# EAGLE design tic_tac_toe (EAGLE 9.6.2)
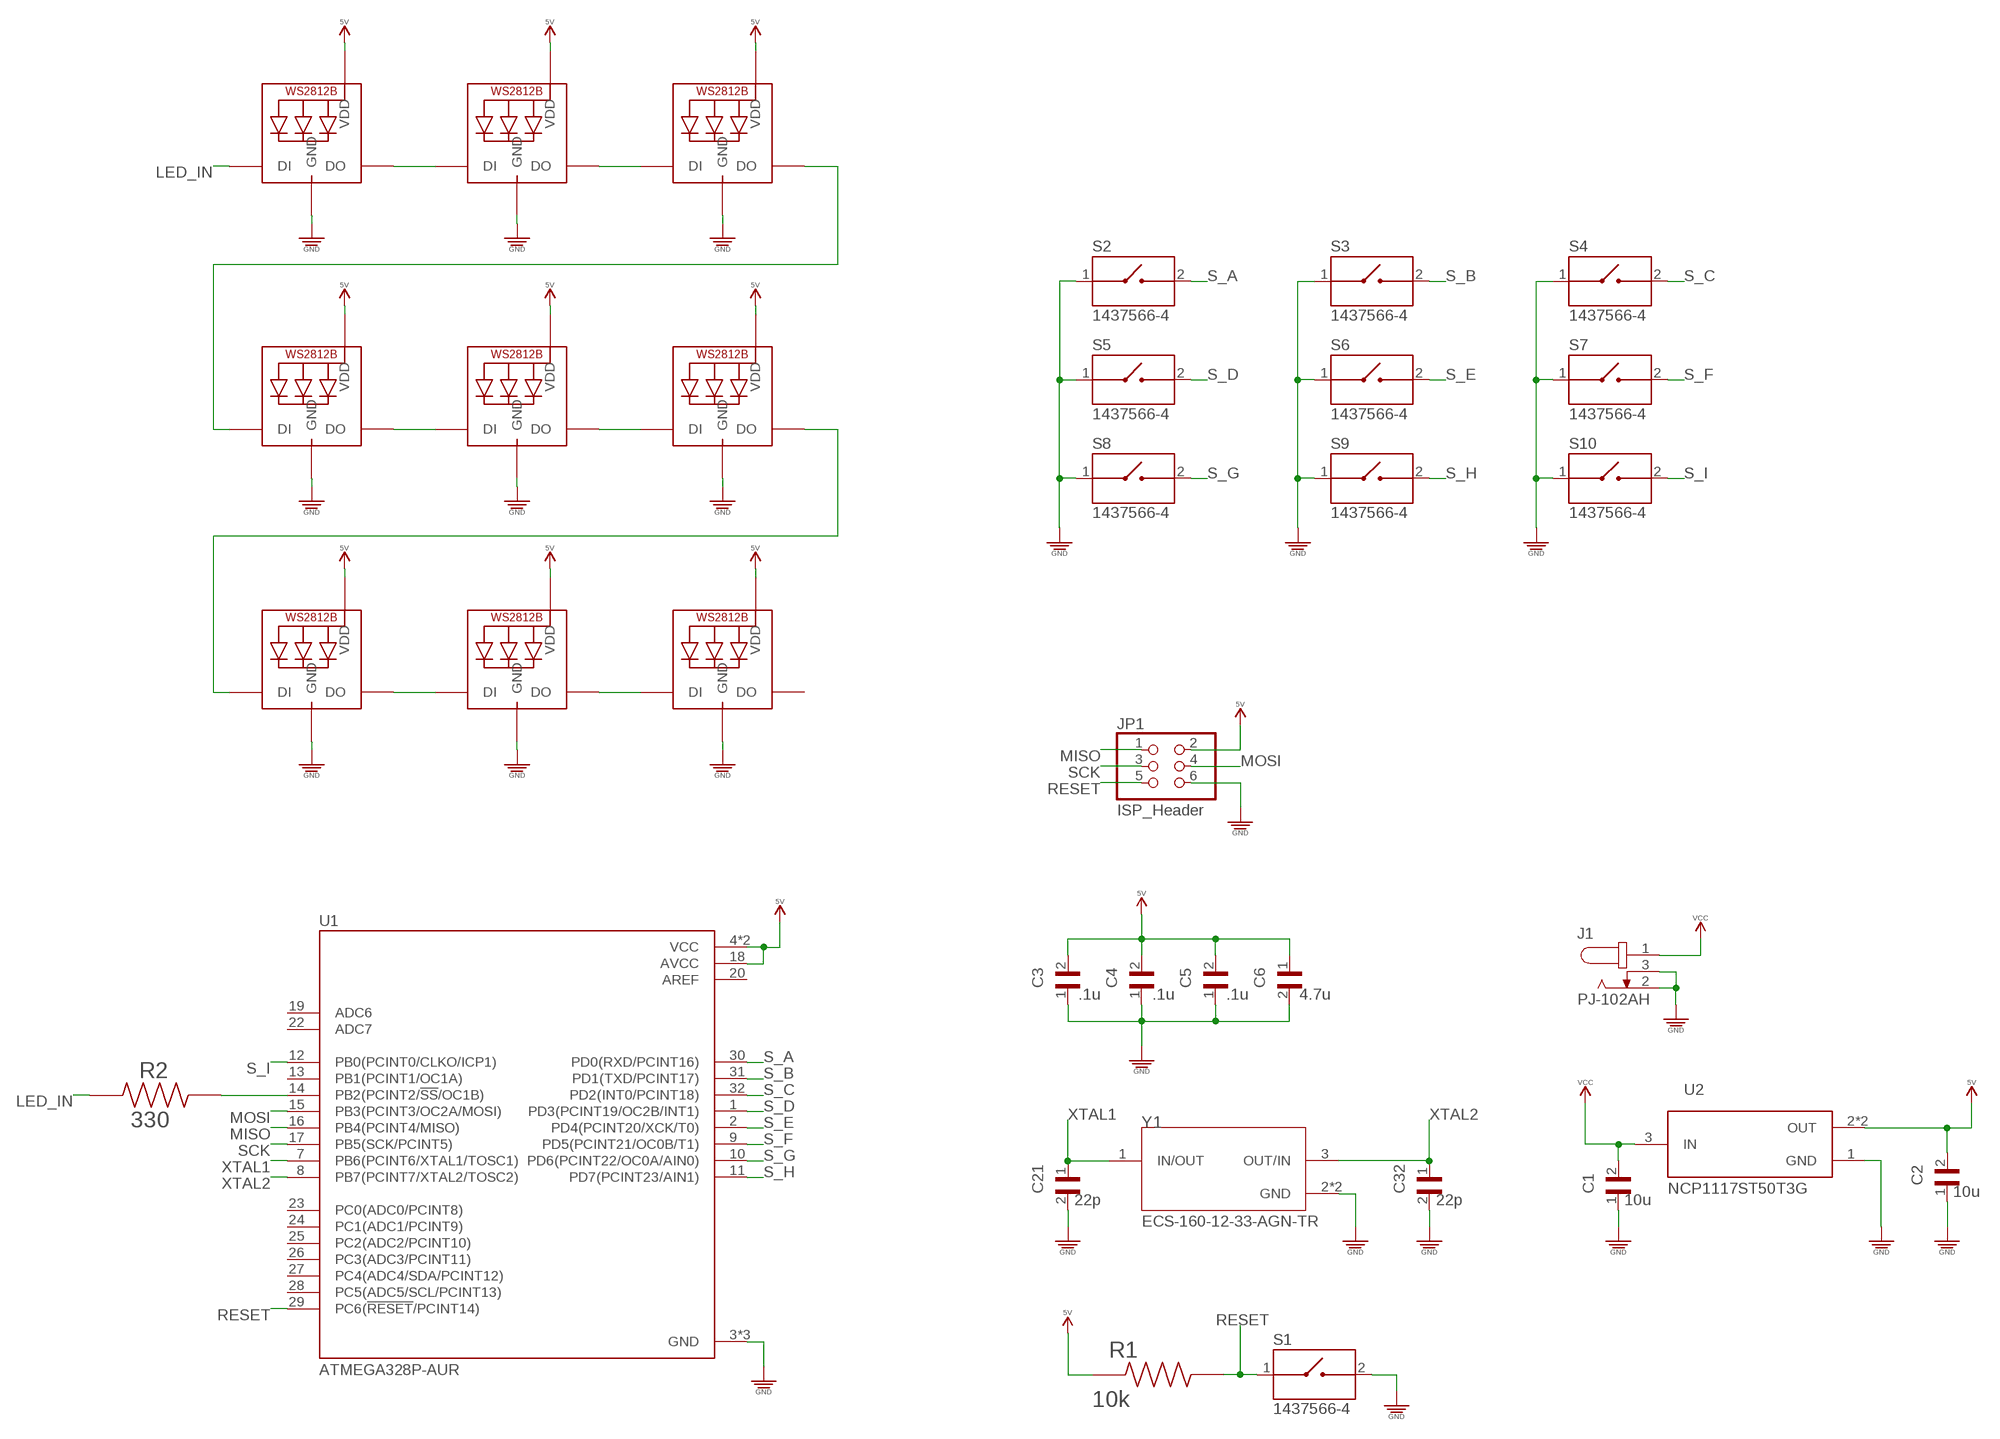
[diagram p0: schematic, sheet 1]

## Parts
C1  10u  TAJR106M006R  [CAPC2012X140N]
C2  10u  TAJR106M006R  [CAPC2012X140N]
C3  .1u  08055F104K4T2A  [CAPC2012X140N]
C4  .1u  08055F104K4T2A  [CAPC2012X140N]
C5  .1u  08055F104K4T2A  [CAPC2012X140N]
C6  4.7u  CL21A475KAQNNNE  [CAPC2012X140N]
C21  22p  C0805C220J5GACTU  [CAPC2012X140N]
C32  22p  C0805C220J5GACTU  [CAPC2012X140N]
J1  PJ-102AH  [CUI_PJ-102AH]
JP1  ISP_Header  PINHD-2X3  [2X03]
LED1  MICROBUILDER_WS2812B_SK6812E  [MICROBUILDER_NEO3535_REVERSE]
LED2  MICROBUILDER_WS2812B_SK6812E  [MICROBUILDER_NEO3535_REVERSE]
LED3  MICROBUILDER_WS2812B_SK6812E  [MICROBUILDER_NEO3535_REVERSE]
LED4  MICROBUILDER_WS2812B_SK6812E  [MICROBUILDER_NEO3535_REVERSE]
LED5  MICROBUILDER_WS2812B_SK6812E  [MICROBUILDER_NEO3535_REVERSE]
LED6  MICROBUILDER_WS2812B_SK6812E  [MICROBUILDER_NEO3535_REVERSE]
LED7  MICROBUILDER_WS2812B_SK6812E  [MICROBUILDER_NEO3535_REVERSE]
LED8  MICROBUILDER_WS2812B_SK6812E  [MICROBUILDER_NEO3535_REVERSE]
LED9  MICROBUILDER_WS2812B_SK6812E  [MICROBUILDER_NEO3535_REVERSE]
R1  10k  CR0805-FX-1002ELF  [RESC2012X60N]
R2  330  RC1206FR-07330RL  [RESC3116X65N]
S1  1437566-4  [SW_1437566-4]
S2  1437566-4  [SW_1437566-4]
S3  1437566-4  [SW_1437566-4]
S4  1437566-4  [SW_1437566-4]
S5  1437566-4  [SW_1437566-4]
S6  1437566-4  [SW_1437566-4]
S7  1437566-4  [SW_1437566-4]
S8  1437566-4  [SW_1437566-4]
S9  1437566-4  [SW_1437566-4]
S10  1437566-4  [SW_1437566-4]
U1  ATMEGA328P-AUR  [QFP80P900X900X120-32N]
U2  NCP1117ST50T3G  [SOT230P700X180-4N]
Y1  ECS-160-12-33-AGN-TR  [XTAL_ECS-160-12-33-AGN-TR]

## Nets
5V: C2.2 C3.2 C4.2 C5.2 C6.1 JP1.2 LED1.1-VDD(VDD) LED2.1-VDD(VDD) LED3.1-VDD(VDD) LED4.1-VDD(VDD) LED5.1-VDD(VDD) LED6.1-VDD(VDD) LED7.1-VDD(VDD) LED8.1-VDD(VDD) LED9.1-VDD(VDD) R1.1 U1.4(VCC) U1.6(VCC) U1.18(AVCC) U2.2(OUT) U2.4(OUT)
GND: C1.1 C2.1 C3.1 C4.1 C5.1 C6.2 C21.2 C32.2 J1.2 J1.3 JP1.6 LED1.3-GND(GND) LED2.3-GND(GND) LED3.3-GND(GND) LED4.3-GND(GND) LED5.3-GND(GND) LED6.3-GND(GND) LED7.3-GND(GND) LED8.3-GND(GND) LED9.3-GND(GND) S1.2 S2.1 S3.1 S4.1 S5.1 S6.1 S7.1 S8.1 S9.1 S10.1 U1.3(GND) U1.5(GND) U1.21(GND) U2.1(GND) Y1.2(GND) Y1.4(GND)
LED_IN: LED1.4-DIN(DI) R2.1
MISO: JP1.1 U1.16(PB4(PCINT4/MISO))
MOSI: JP1.4 U1.15(PB3(PCINT3/OC2A/MOSI))
N$1: R2.2 U1.14(PB2(PCINT2/!SS!/OC1B))
N$2: LED1.2-DOUT(DO) LED2.4-DIN(DI)
N$3: LED2.2-DOUT(DO) LED3.4-DIN(DI)
N$4: LED4.2-DOUT(DO) LED5.4-DIN(DI)
N$5: LED5.2-DOUT(DO) LED6.4-DIN(DI)
N$6: LED7.2-DOUT(DO) LED8.4-DIN(DI)
N$7: LED8.2-DOUT(DO) LED9.4-DIN(DI)
N$9: LED3.2-DOUT(DO) LED4.4-DIN(DI)
N$14: LED6.2-DOUT(DO) LED7.4-DIN(DI)
RESET: JP1.5 R1.2 S1.1 U1.29(PC6(!RESET!/PCINT14))
S_A: S2.2 U1.30(PD0(RXD/PCINT16))
S_B: S3.2 U1.31(PD1(TXD/PCINT17))
S_C: S4.2 U1.32(PD2(INT0/PCINT18))
S_D: S5.2 U1.1(PD3(PCINT19/OC2B/INT1))
S_E: S6.2 U1.2(PD4(PCINT20/XCK/T0))
S_F: S7.2 U1.9(PD5(PCINT21/OC0B/T1))
S_G: S8.2 U1.10(PD6(PCINT22/OC0A/AIN0))
S_H: S9.2 U1.11(PD7(PCINT23/AIN1))
S_I: S10.2 U1.12(PB0(PCINT0/CLKO/ICP1))
SCK: JP1.3 U1.17(PB5(SCK/PCINT5))
VCC: C1.2 J1.1 U2.3(IN)
XTAL1: C21.1 U1.7(PB6(PCINT6/XTAL1/TOSC1)) Y1.1(IN/OUT)
XTAL2: C32.1 U1.8(PB7(PCINT7/XTAL2/TOSC2)) Y1.3(OUT/IN)
Unconnected: LED9.2-DOUT(DO) U1.13(PB1(PCINT1/OC1A)) U1.19(ADC6) U1.22(ADC7) U1.23(PC0(ADC0/PCINT8)) U1.24(PC1(ADC1/PCINT9)) U1.25(PC2(ADC2/PCINT10)) U1.26(PC3(ADC3/PCINT11)) U1.27(PC4(ADC4/SDA/PCINT12)) U1.28(PC5(ADC5/SCL/PCINT13))

## Power pins joined to a net without a drawn wire
AREF: U1.20(AREF)

## Library data of the parts
C1 C2 = TAJR106M006R:TAJR106M006R: Cap Tant Solid 10uF 6.3V R CASE 20% (2.05 X 1.3 X 1.2mm) Inward L SMD 2012-12 6 Ohm 125C T/R; DESCRIPTION: 10 µF Molded Tantalum Capacitors 6.3 V 0805 (2012 Metric) 6Ohm; DIGI-KEY_PART_NUMBER: 478-3051-1-ND; MF: AVX; MP: TAJR106M006R; PACKAGE: SMD-2 AVX; PURCHASE-URL: https://pricing.snapeda.com/search/part/TAJR106M006R/?ref=eda
C3-C5 = 08055F104K4T2A:08055F104K4T2A: 0805 100 nF 50 V ±10 % Tolerance X8R SMT Multilayer Ceramic Capacitor; DESCRIPTION: 0.1 µF ±10% 50V Ceramic Capacitor X8R 0805 (2012 Metric); DIGI-KEY_PART_NUMBER: 478-3614-1-ND; MF: AVX; MP: 08055F104K4T2A; PACKAGE: 2012 AVX; PURCHASE-URL: https://pricing.snapeda.com/search/part/08055F104K4T2A/?ref=eda
C6 = CL21A475KAQNNNE:CL21A475KAQNNNE: CL21 Series 4.7 uF 25 V ±10 % Tolerance X5R SMT Multilayer Ceramic Capacitor; DESCRIPTION: 4.7 µF ±10% 25V Ceramic Capacitor X5R 0805 (2012 Metric); DIGI-KEY_PART_NUMBER: 1276-1244-1-ND; MF: Samsung Electro-Mechanics; MP: CL21A475KAQNNNE; PACKAGE: 0805 Samsung; PURCHASE-URL: https://pricing.snapeda.com/search/part/CL21A475KAQNNNE/?ref=eda
C21 C32 = C0805C220J5GACTU:C0805C220J5GACTU: SMD 0805 CERAMIC NPO -55^+125 22 PF +/-5? 50V; DESCRIPTION: 22 pF ±5% 50V Ceramic Capacitor C0G, NP0 0805 (2012 Metric); DIGI-KEY_PART_NUMBER: 399-C0805C220J5GAC7800CT-ND; MF: KEMET; MP: C0805C220J5GACTU; PACKAGE: 0805 Kemet; PURCHASE-URL: https://pricing.snapeda.com/search/part/C0805C220J5GACTU/?ref=eda
J1 = PJ-102AH:PJ-102AH: 2.0 mm Center Pin, 5.0 A, Right Angle, Through Hole, Tapered Pins, Dc Power Jack Connector Check prices <https://pricing.snapeda.com/parts/PJ-102AH/CUI%20Devices/view-part?ref=eda>; AVAILABILITY: In Stock; CUI_PURCHASE_URL: https://www.cuidevices.com/product/interconnect/connectors/dc-power-connectors/jacks/pj-102ah?utm_source=snapeda.com&utm_medium=referral&utm_campaign=snapedaBOM; DESCRIPTION: 2.0 x 6.5 mm, 5.0 A, Horizontal, Through Hole, Tapered Pins, Dc Power Jack Connector; MF: CUI Devices; MP: PJ-102AH; PACKAGE: None; PRICE: None; PURCHASE-URL: https://pricing.snapeda.com/search/part/PJ-102AH/?ref=eda
JP1 = pinhead:PINHD-2X3: PIN HEADER
LED1-LED9 = Adafruit Slider Trinkey:MICROBUILDER_WS2812B
R1 = CR0805-FX-1002ELF:CR0805-FX-1002ELF: RESISITOR, 0805, 10KR, 1%; Power Rating:125mW; Resistance:10kohm; Resistance Tolerance:± 1%; Series:CR; Operating Temperature Range:-55°C to +155°C; Resistor Element Type:Thick Film; Voltage, Rating:100V; Temperature Coefficient:± 100ppm; Case Style:0805; DESCRIPTION: 10 kOhms ±1% 0.125W, 1/8W Chip Resistor 0805 (2012 Metric) Moisture Resistant Thick Film; DIGI-KEY_PART_NUMBER: CR0805-FX-1002ELFTR-ND; MF: Bourns; MP: CR0805-FX-1002ELF; PACKAGE: 2012 Bourns; PURCHASE-URL: https://pricing.snapeda.com/search/part/CR0805-FX-1002ELF/?ref=eda
R2 = RC1206FR-07330RL:RC1206FR-07330RL: SMD resistor,m.-f. 330R 0; DESCRIPTION: 330 Ohms ±1% 0.25W, 1/4W Chip Resistor 1206 (3216 Metric) Moisture Resistant Thick Film; DIGI-KEY_PART_NUMBER: 311-330FRCT-ND; MF: Yageo; MP: RC1206FR-07330RL; PACKAGE: 3116 Yageo; PURCHASE-URL: https://pricing.snapeda.com/search/part/RC1206FR-07330RL/?ref=eda
S1-S10 = 1437566-4:1437566-4: SWITCH TACTILE SPST-NO 0.05A 24V; COMMENT: 1437566-4; CONFIGURATION_POLE-THROW: Single Pole - Single Throw; CONTACT_CURRENT_RATING: 50 mA; DESCRIPTION: Tactile Switch SPST-NO Top Actuated Surface Mount; DIGI-KEY_PART_NUMBER: 2266-1437566-4TR-ND; MF: TE Connectivity; MP: 1437566-4; PACKAGE: None
U1 = ATMEGA328P-AUR:ATMEGA328P-AUR: ATmega328P Series 8 Bit 2 kB RAM 32 kB Flash SMT Microcontroller - TQFP-32; DESCRIPTION: AVR AVR® ATmega Microcontroller IC 8-Bit 20MHz 32KB (16K x 16) FLASH 32-TQFP (7x7); DIGI-KEY_PART_NUMBER: ATMEGA328P-AURTR-ND; MF: Microchip Technology; MP: ATMEGA328P-AUR; PACKAGE: None; PURCHASE-URL: https://pricing.snapeda.com/search/part/ATMEGA328P-AUR/?ref=eda
U2 = NCP1117ST50T3G:NCP1117ST50T3G: 1.0 A Low-Dropout Positive ,Fixed and Adjustable,Voltage Regulators; DESCRIPTION: Linear Voltage Regulator IC Positive Fixed 1 Output 1A SOT-223; DIGI-KEY_PART_NUMBER: NCP1117ST50T3GOSCT-ND; MF: ON Semiconductor; MP: NCP1117ST50T3G; PACKAGE: SOT-223-4 ON Semiconductor; PURCHASE-URL: https://pricing.snapeda.com/search/part/NCP1117ST50T3G/?ref=eda
Y1 = ECS-160-12-33-AGN-TR:ECS-160-12-33-AGN-TR; DESCRIPTION: 16 MHz ±25ppm Crystal 12pF 80 Ohms 4-SMD, No Lead; DIGI-KEY_PART_NUMBER: XC2930CT-ND; MF: ECS Inc.; MP: ECS-160-12-33-AGN-TR; PACKAGE: SMD-4 ECS International; PURCHASE-URL: https://pricing.snapeda.com/search/part/ECS-160-12-33-AGN-TR/?ref=eda

## Board
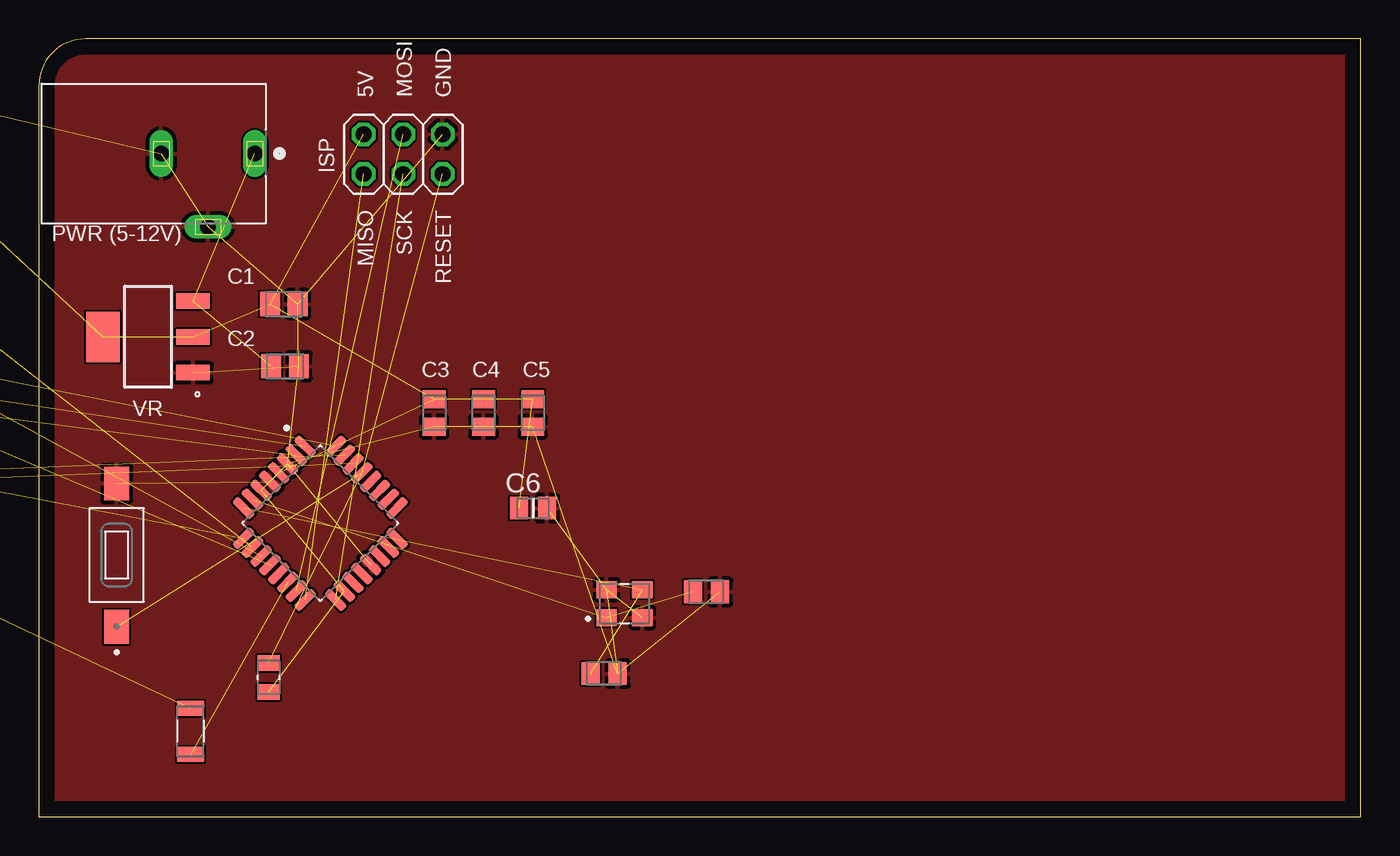
[diagram p1: board, top side]
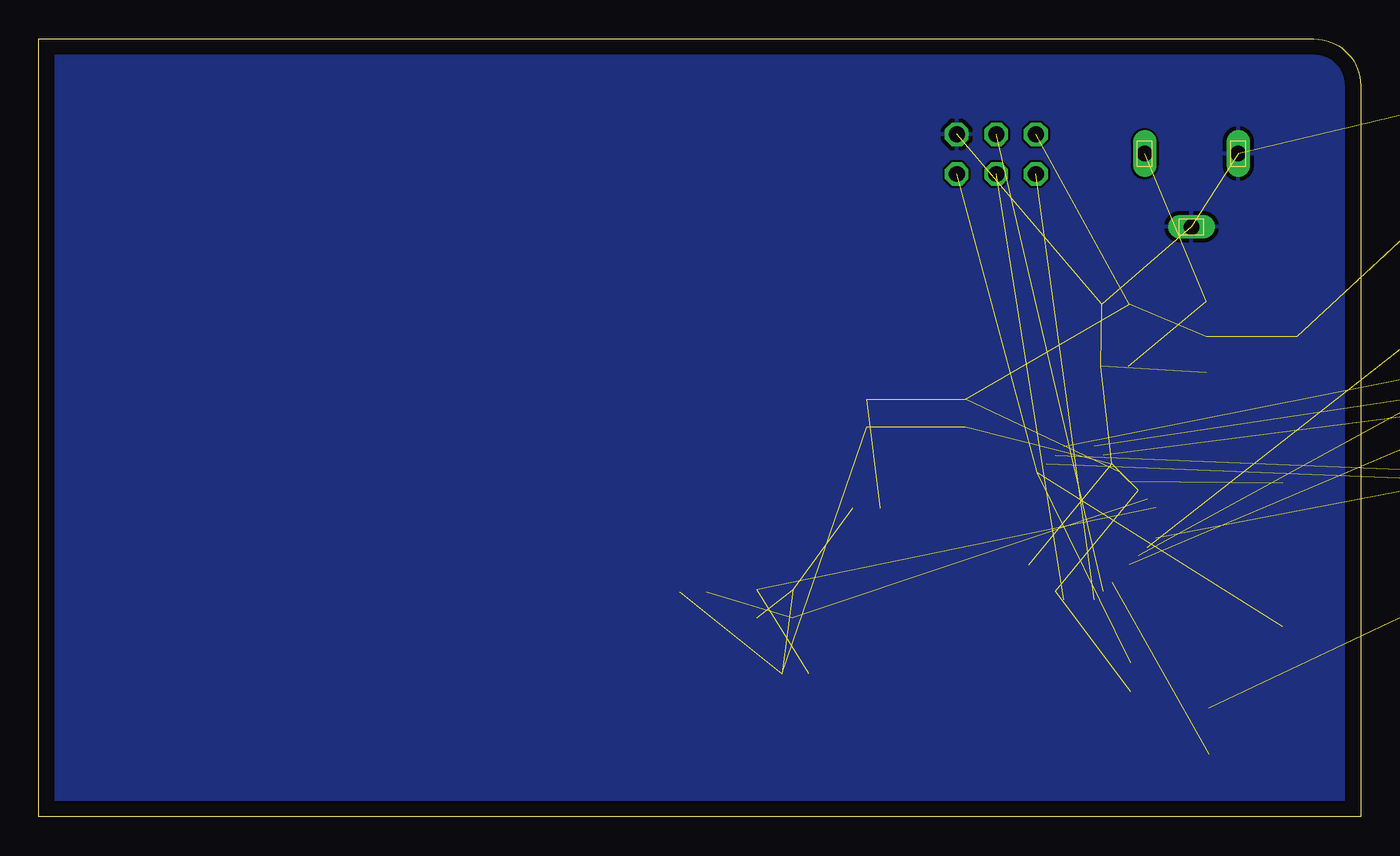
[diagram p2: board, bottom side, seen from below]

Size 85 x 50 mm. Coordinates in mm from the lower left corner, seen from the top.
Outline: 0,0 85,0 85,50 3,50 arc90 0,47 0,0
Copper layers (1*16): Top 0.035mm / dielectric 1.5mm / Bottom 0.035mm
Design rules "default": minimum track width 6mil, minimum drill 0.35mm, track to track 6mil, track to pad 6mil, pad to pad 6mil, via to via 6mil, smd to smd 6mil, copper to edge 40mil, drill to drill 6mil, minimum pad ring 10mil, minimum via ring 8mil, stop-mask expansion 4mil, vias tented up to drill 0mil, thermal gap 10mil

### Footprints (pad centres in the part's own frame; a part is rotated, then mirrored left to right if it is on the bottom)
CAPC2012X140N = smd 1.28 x 1.56: 1 -0.889,0; 2 0.889,0
CAPC2012X140N' = smd 1.16 x 1.47: 1 -0.88,0; 2 0.88,0
CAPC2012X140N'' = smd 1.15 x 1.45: 1 -0.9,0; 2 0.9,0
CAPC2012X140N''' = smd 1.16 x 1.47: 1 -0.875,0; 2 0.875,0
CUI_PJ-102AH = drill 1 long: 1 -6.5,0; 2 -0.5,0; 3 -3.5,4.7
2X03 = drill 1.016 octagon: 1 -2.54,-1.27; 2 -2.54,1.27; 3 0,-1.27; 4 0,1.27; 5 2.54,-1.27; 6 2.54,1.27
MICROBUILDER_NEO3535_REVERSE = smd 1.2 x 0.9 bottom: 1-VDD 2.65,-0.75; 2-DOUT 2.65,0.75; 3-GND -2.65,0.75; 4-DIN -2.65,-0.75
RESC2012X60N = smd 1 x 1.42: 1 -0.935,0; 2 0.935,0
RESC3116X65N = smd 0.97 x 1.73: 1 -1.48,0; 2 1.48,0
SW_1437566-4 = smd 2.18 x 1.6: 1 -4.6,0; 2 4.6,0
QFP80P900X900X120-32N = smd 1.6 x 0.55: 1 -4.18,2.8; 2 -4.18,2; 3 -4.18,1.2; 4 -4.18,0.4; 5 -4.18,-0.4; 6 -4.18,-1.2; 7 -4.18,-2; 8 -4.18,-2.8; 17 4.18,-2.8; 18 4.18,-2; 19 4.18,-1.2; 20 4.18,-0.4; 21 4.18,0.4; 22 4.18,1.2; 23 4.18,2; 24 4.18,2.8 | smd 0.55 x 1.6: 9 -2.8,-4.18; 10 -2,-4.18; 11 -1.2,-4.18; 12 -0.4,-4.18; 13 0.4,-4.18; 14 1.2,-4.18; 15 2,-4.18; 16 2.8,-4.18; 25 2.8,4.18; 26 2,4.18; 27 1.2,4.18; 28 0.4,4.18; 29 -0.4,4.18; 30 -1.2,4.18; 31 -2,4.18; 32 -2.8,4.18
SOT230P700X180-4N = smd 2.15 x 1: 1 -2.9,2.3; 2 -2.9,0; 3 -2.9,-2.3 | smd 2.15 x 3.25: 4 2.9,0
XTAL_ECS-160-12-33-AGN-TR = smd 1.3 x 1.1: 1 -1.15,-0.9; 2 1.15,-0.9; 3 1.15,0.9; 4 -1.15,0.9

### Placement (x,y rotation side)
C1  15.83,28.95 180 top
C2  15.75,32.95 180 top
C3  .1u  [CAPC2012X140N']  25.42,25.95 90 top
C4  .1u  [CAPC2012X140N']  28.59,25.95 90 top
C5  .1u  [CAPC2012X140N']  31.76,25.95 90 top
C6  4.7u  [CAPC2012X140N'']  31.79,19.83 0 top
C21  22p  [CAPC2012X140N''']  42.93,14.45 0 top
C32  22p  [CAPC2012X140N''']  36.35,9.2 0 top
J1  7.38,42.62 180 top
JP1  23.43,42.59 0 top
LED1  -54.61,39.37 0 top  (outside the outline)
LED2  -16.51,48.26 0 top  (outside the outline)
LED3  -39.37,48.26 0 top  (outside the outline)
LED4  -16.51,55.88 0 top  (outside the outline)
LED5  -39.37,55.88 0 top  (outside the outline)
LED6  -16.51,63.5 0 top  (outside the outline)
LED7  -39.37,63.5 0 top  (outside the outline)
LED8  -16.51,71.12 0 top  (outside the outline)
LED9  -39.37,71.12 0 top  (outside the outline)
R1  14.77,8.95 90 top
R2  9.75,5.5 270 top
S1  5,16.82 90 top
S2  -44.45,20.32 0 top  (outside the outline)
S3  -57.15,20.32 0 top  (outside the outline)
S4  -19.05,30.48 0 top  (outside the outline)
S5  -31.75,30.48 0 top  (outside the outline)
S6  -44.45,30.48 0 top  (outside the outline)
S7  -57.15,30.48 0 top  (outside the outline)
S8  -19.05,39.37 0 top  (outside the outline)
S9  -31.75,39.37 0 top  (outside the outline)
S10  -44.45,39.37 0 top  (outside the outline)
U1  18.1,18.87 315 top
U2  7.02,30.85 180 top
Y1  37.66,13.7 0 top

### Tracks (layer width: path | path; a pad name or v marks a point on that pad's centre or on a via)
5V  (20 unrouted)
GND  (35 unrouted)
  pour Top: 0,50 0,0 85,0 85,50
  pour Bottom: 85,50 0,50 0,0 85,0
LED_IN  (1 unrouted)
MISO  (1 unrouted)
MOSI  (1 unrouted)
N$1  (1 unrouted)
N$2  (1 unrouted)
N$3  (1 unrouted)
N$4  (1 unrouted)
N$5  (1 unrouted)
N$6  (1 unrouted)
N$7  (1 unrouted)
N$9  (1 unrouted)
N$14  (1 unrouted)
RESET  (3 unrouted)
S_A  (1 unrouted)
S_B  (1 unrouted)
S_C  (1 unrouted)
S_D  (1 unrouted)
S_E  (1 unrouted)
S_F  (1 unrouted)
S_G  (1 unrouted)
S_H  (1 unrouted)
S_I  (1 unrouted)
SCK  (1 unrouted)
VCC  (2 unrouted)
XTAL1  (2 unrouted)
XTAL2  (2 unrouted)

### Text on the board
tPlace: 5V | MOSI | GND | ISP | MISO | SCK | RESET | PWR (5-12V) | C1 | C2 | C3 | C4 | C5 | VR